# EasyEDA schematic board.json
TITLE: Arduino Nano & WS2812B_Light your life; REV: 1.0; Date: 2017-12-23; Sheet: 1/1; Drawn By: Your Name
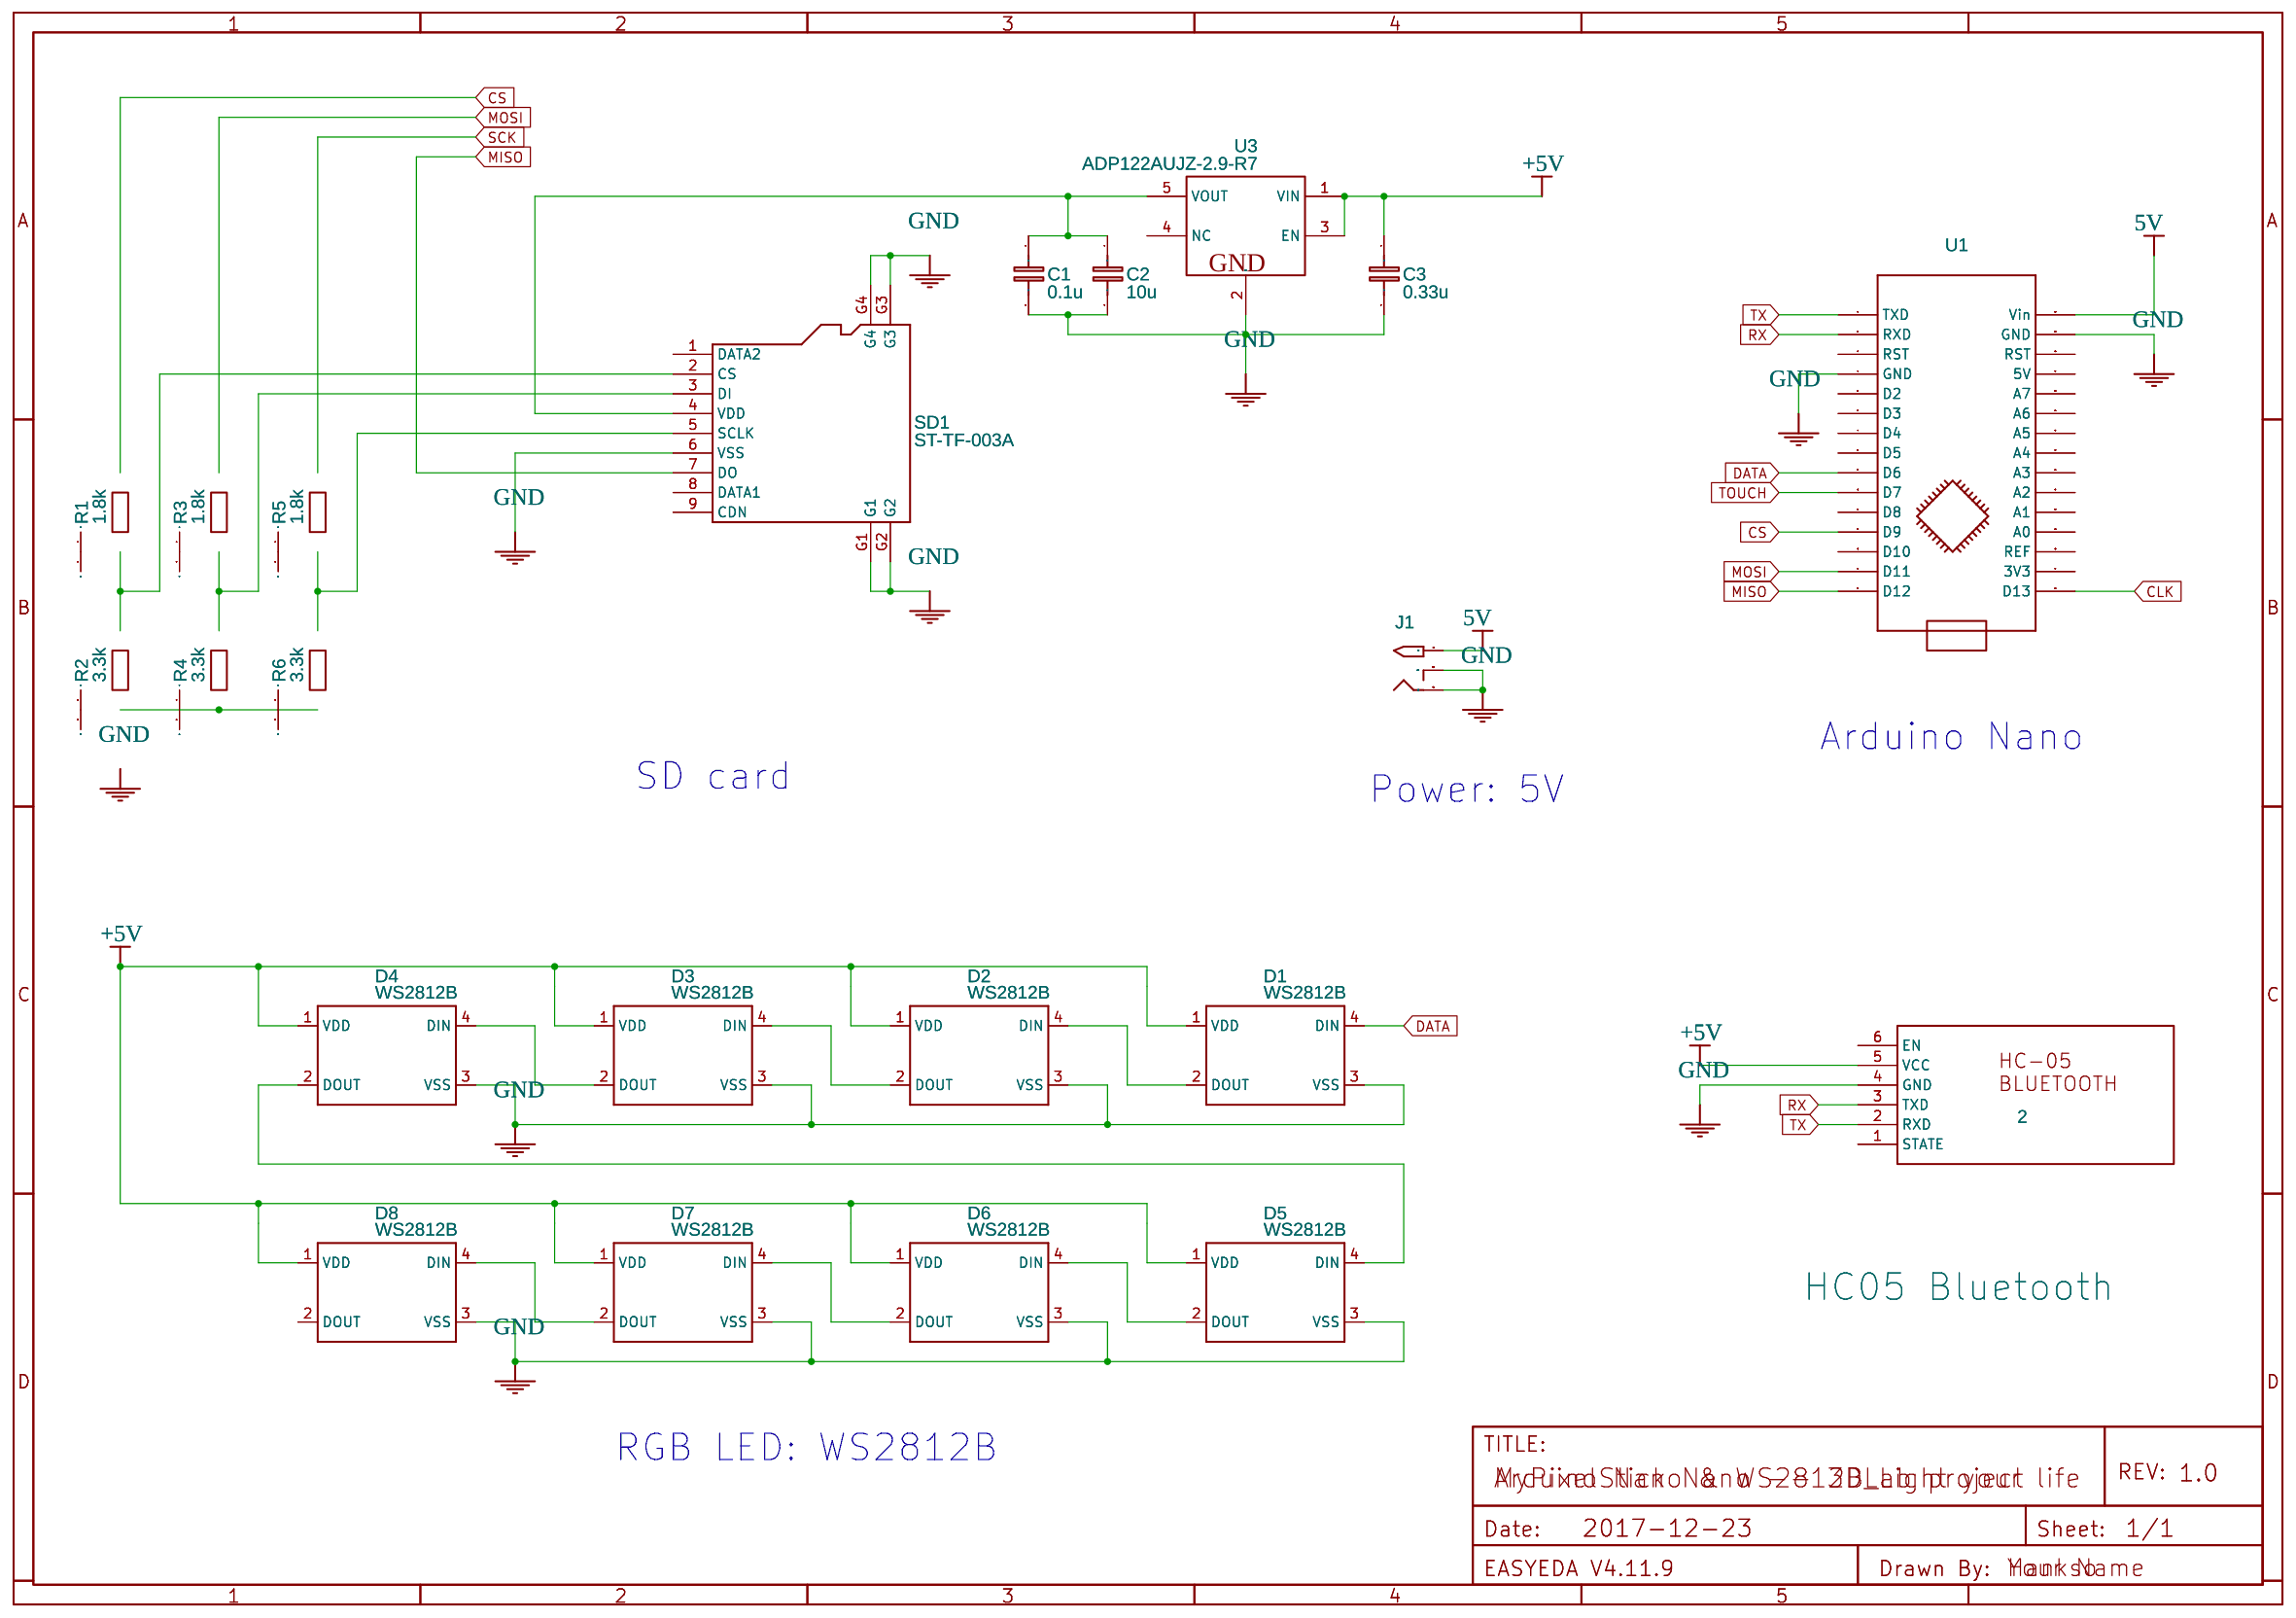
[diagram p0: schematic sheet]

## Parts
2  HC05 Bluetooth  [hc05]
C1  0.1u  [C0805]
C2  10u  [C0805]
C3  0.33u  [C0805]
D1  WS2812B  [WS2812B]
D2  WS2812B  [WS2812B]
D3  WS2812B  [WS2812B]
D4  WS2812B  [WS2812B]
D5  WS2812B  [WS2812B]
D6  WS2812B  [WS2812B]
D7  WS2812B  [WS2812B]
D8  WS2812B  [WS2812B]
J1  2.1MMJACKTHM  [PJ-102A]
R1  1.8k  [R0805]
R2  3.3k  [R0805]
R3  1.8k  [R0805]
R4  3.3k  [R0805]
R5  1.8k  [R0805]
R6  3.3k  [R0805]
SD1  ST-TF-003A  [hc05]
U1  NO  [ARDUINO_NANO]
U3  ADP122AUJZ-2.9-R7  [SOT23-5]

## Library data of the parts
2 = -: Contributor: Penoff; sourceId: KecxTRdzV; Supplier: SparkFun; Manufacturer Part: ?
C1-C3 = Capacitor: Manufacturer Part: ?
D1-D8 = -: catid: 20; Contributor: SparkFun; sourceId: 0SMGXfxrl; Manufacturer Part: ?
J1 = -: 2.1mm x 5.5mm THM DC jack with internal switch. Digikey part #PJ-102A, 4UCON part #05537; catid: 20; Contributor: Adafruit; sourceId: Oa4mgasK2; Manufacturer Part: ?
R1-R6 = Resistor: Manufacturer Part: ?
SD1 = -: Micro SD Card Socket; catid: 20; Supplier: SeeedStudio; SeeedStudio: 320090000; sourceId: hKkiECAx7
U1 = -: catid: 20; sourceId: g2wyehQ7j; Manufacturer Part: ?
U3 = -: 300 mA, Low Quiescent Current, CMOS Linear Regulator, 2.3 to 5.5 V Vin, 2.9 V Vout, Industrial, 5-pin SOT23 (UJ-5), Reel; catid: 20; sourceId: Wmf9rJ1Vd; Manufacturer Part: ?

## Nets
5V: J1.TIP U1.30(Vin)
+5V: 2.5(VCC) C3.1 D1.1(VDD) D2.1(VDD) D3.1(VDD) D4.1(VDD) D5.1(VDD) D6.1(VDD) D7.1(VDD) D8.1(VDD) U3.1(VIN) U3.3(EN)
GND: 2.4(GND) C1.2 C2.2 C3.2 D1.3(VSS) D2.3(VSS) D3.3(VSS) D4.3(VSS) D5.3(VSS) D6.3(VSS) D7.3(VSS) D8.3(VSS) J1.RING J1.RING_SW SD1.6(VSS) SD1.G1 SD1.G2 SD1.G3 SD1.G4 U1.4(GND) U1.29(GND) U3.2(GND)
CLK: U1.16(D13)
CS: R1.2 U1.12(A4)
DATA: D1.4(DIN) U1.9(D6)
MISO: SD1.7(DO) U1.15(D12)
MOSI: R3.2 U1.14(A5)
RX: 2.3(TXD) U1.2(RXD)
SCK: R5.2
TOUCH: U1.10(D7)
TX: 2.2(RXD) U1.1(TXD)
Net-(C1-1): C1.1 C2.1 SD1.4(VDD) U3.5(VOUT)
Net-(D1-2): D1.2(DOUT) D2.4(DIN)
Net-(D2-2): D2.2(DOUT) D3.4(DIN)
Net-(D3-2): D3.2(DOUT) D4.4(DIN)
Net-(D4-2): D4.2(DOUT) D5.4(DIN)
Net-(D5-2): D5.2(DOUT) D6.4(DIN)
Net-(D6-2): D6.2(DOUT) D7.4(DIN)
Net-(D7-2): D7.2(DOUT) D8.4(DIN)
Net-(R1-1): R1.1 R2.2 SD1.2(CS)
Net-(R2-1): R2.1 R4.1 R6.1
Net-(R3-1): R3.1 R4.2 SD1.3(DI)
Net-(R5-1): R5.1 R6.2 SD1.5(SCLK)

Not connected (* = marked no-connect by the designer): 2 1(STATE) 6(EN); D8 2(DOUT); SD1 1(DATA2) 8(DATA1) 9(CDN); U1 3(RST) 5(D2) 6(D3) 7(D4) 8(D5) 11(D8) 13(D10) 17(3V3) 18(REF) 19(A0) 20(A1) 21(A2) 22(A3) 25(A6) 26(A7) 27(5V) 28(RST); U3 4(NC)

## Notes on the sheet
- Arduino Nano
- SD card
- Power: 5V
- RGB LED: WS2812B
